# Altium schematic sheet 39-996 - SM Clock-Timer.SchDoc
size A2
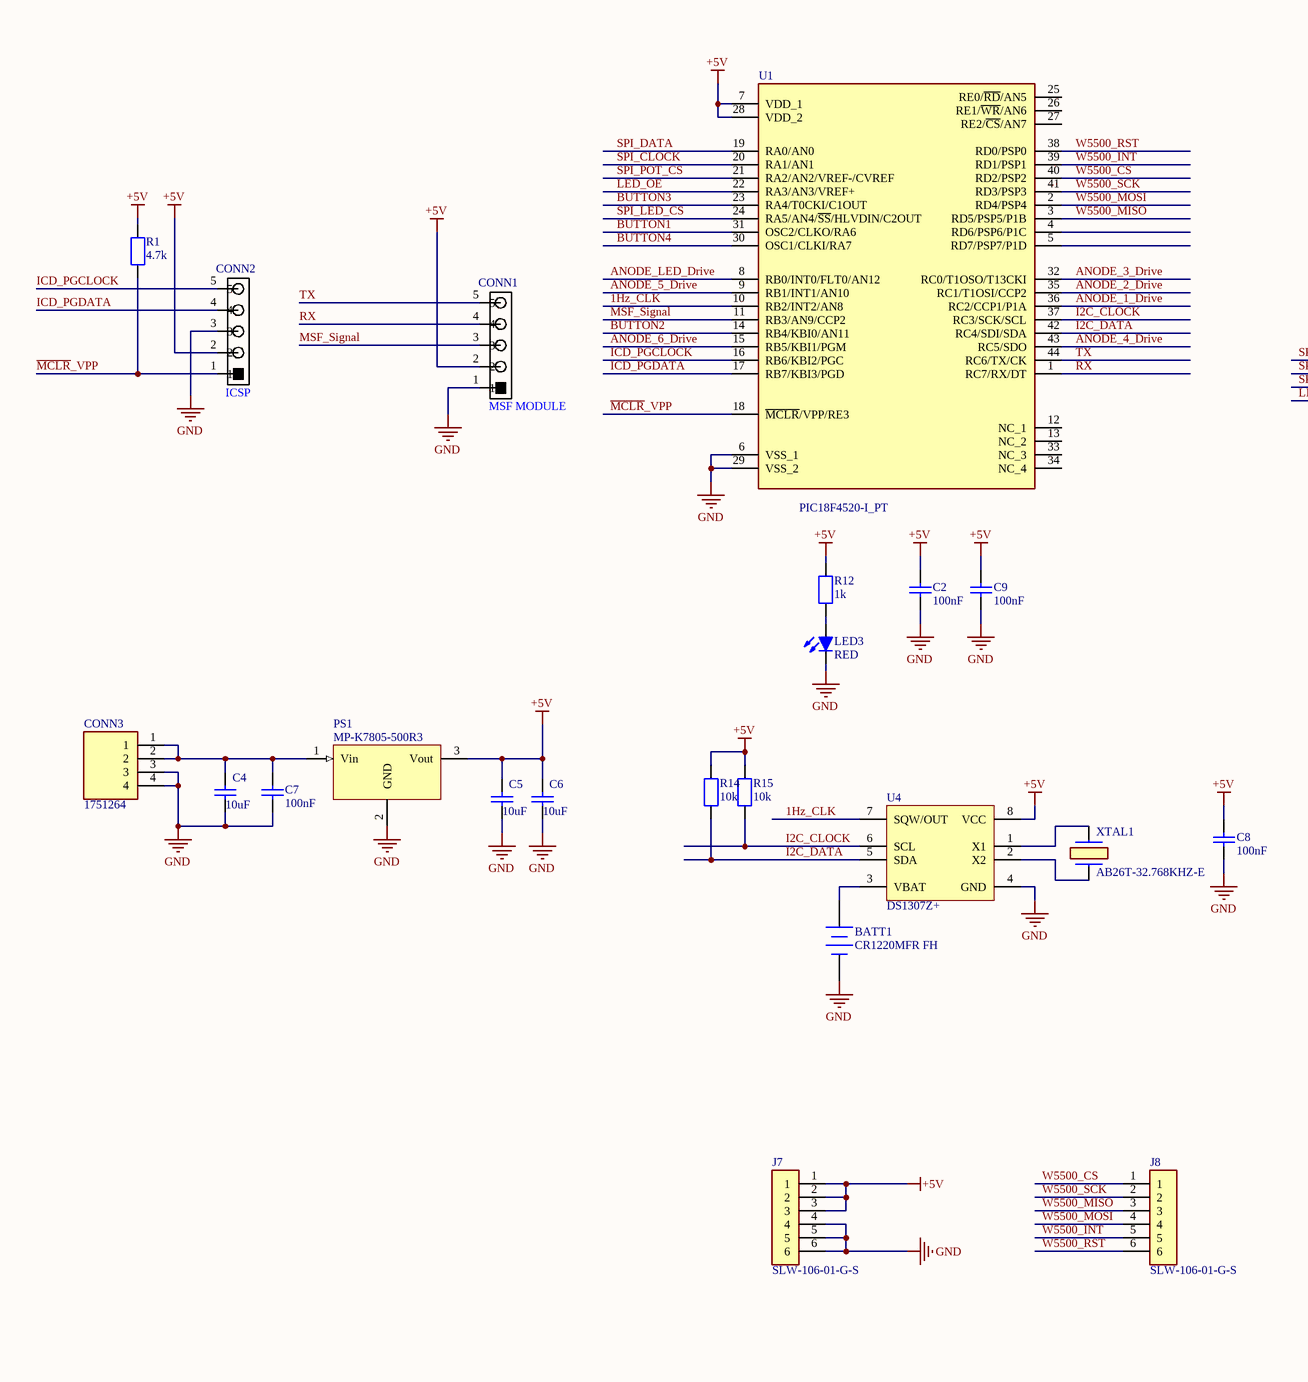
[diagram p0: 39-996 - SM Clock-Timer.SchDoc, left]
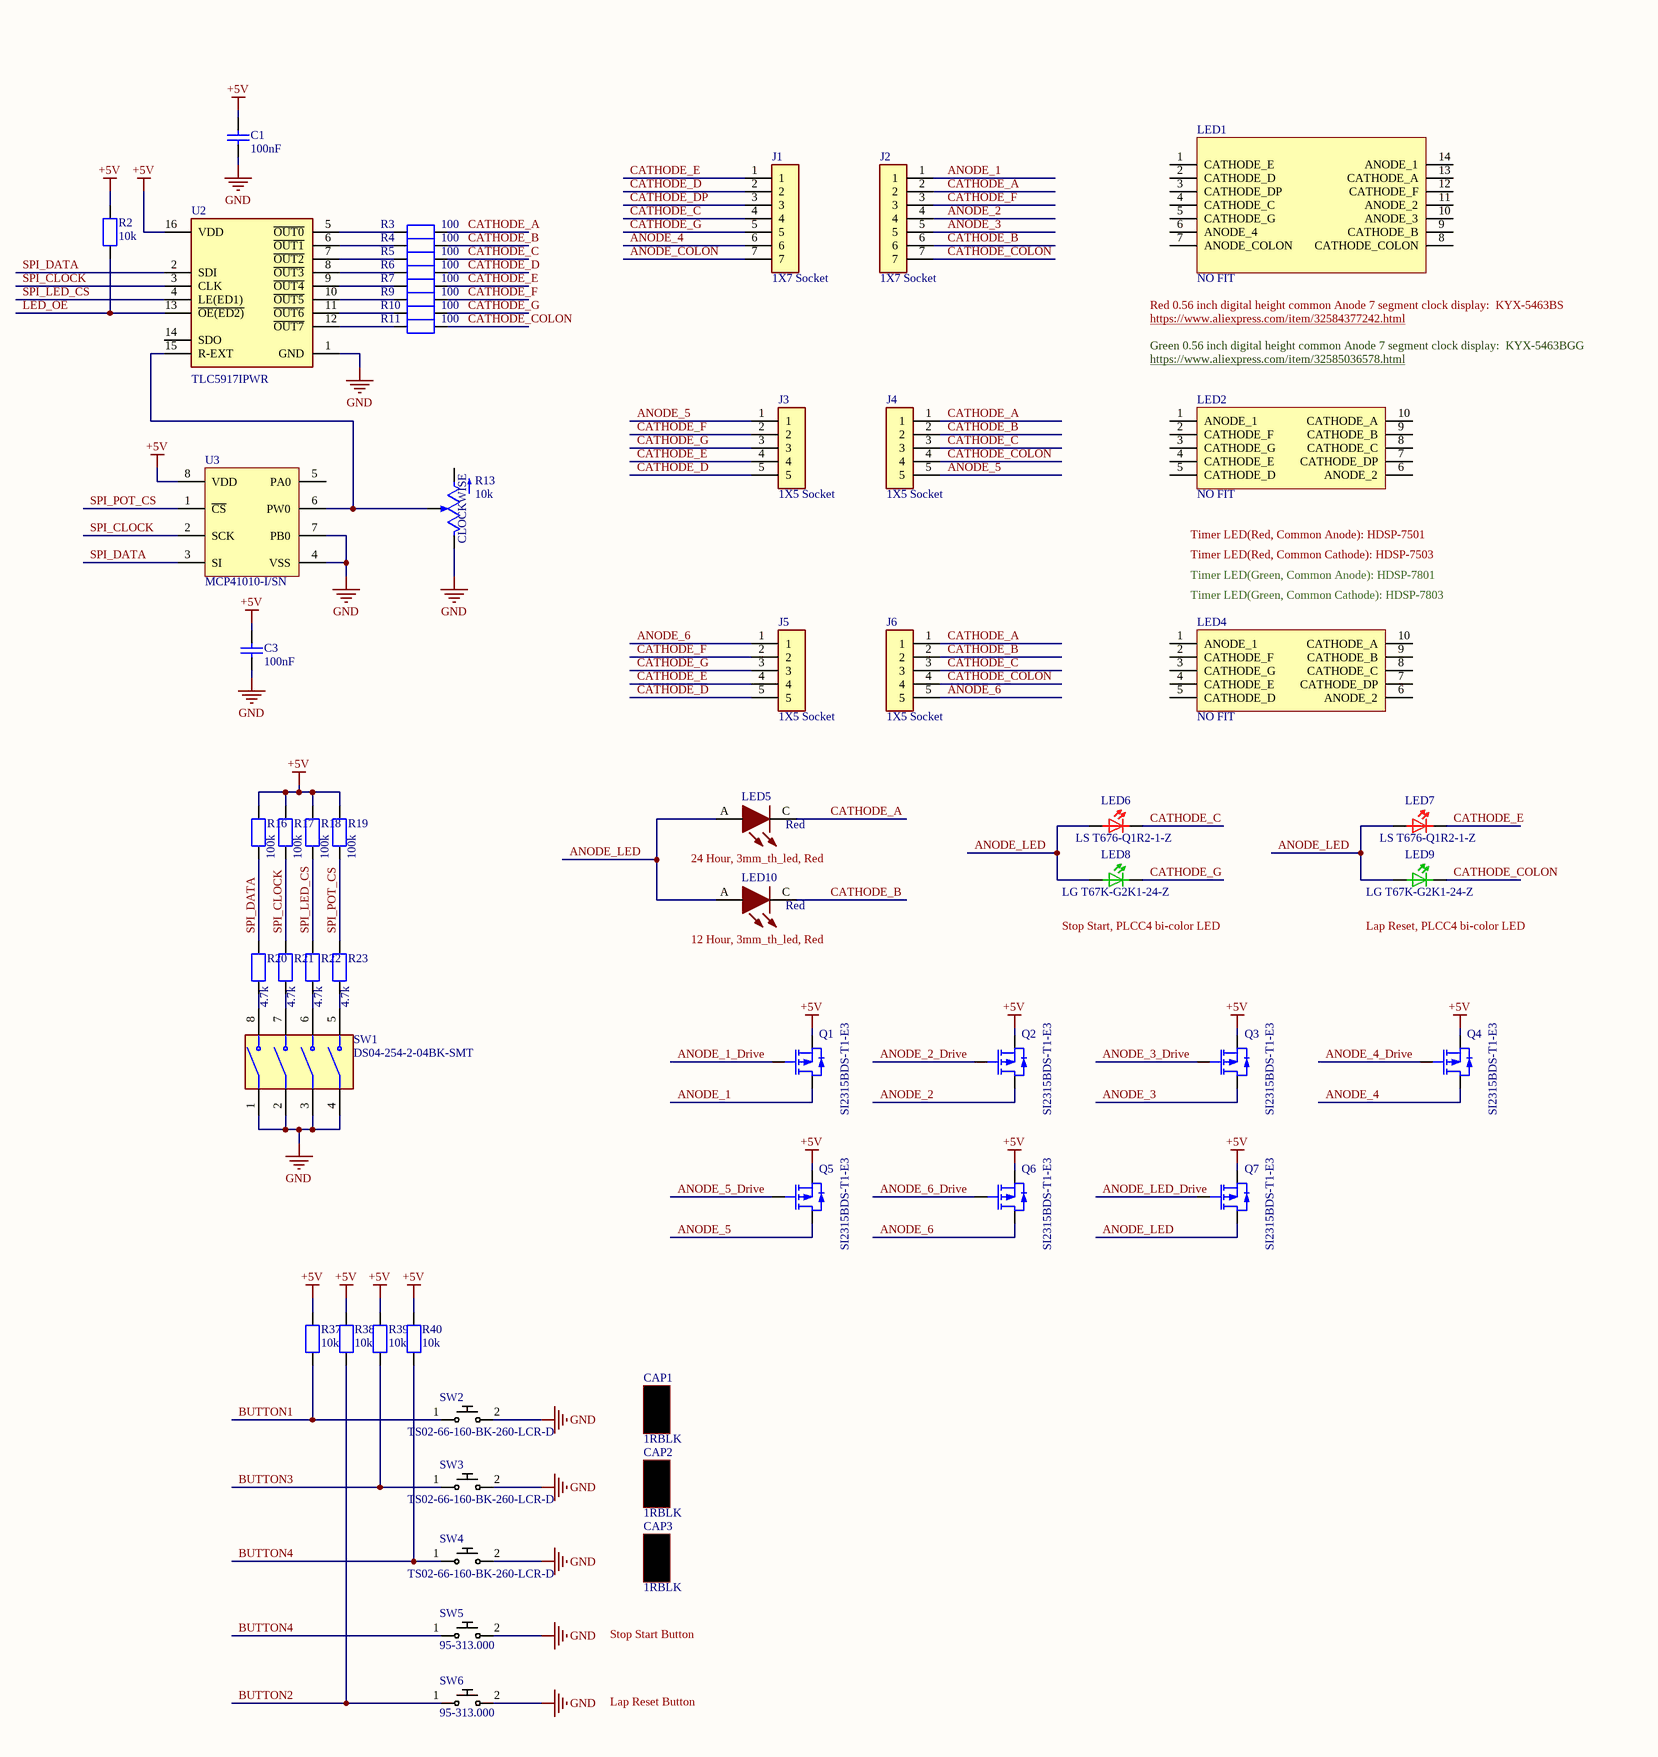
[diagram p1: 39-996 - SM Clock-Timer.SchDoc, right]

## Parts
BATT1  CR1220MFR FH  [CR1220MFRFH]
C1  100nF  [C0603]
C2  100nF  [C0603]
C3  100nF  [C0603]
C4  10uF  [C1206]
C5  10uF  [C1206]
C6  10uF  [C1206]
C7  100nF  [C0603]
C8  100nF  [C0603]
C9  100nF  [C0603]
CAP1  1RBLK  [1RBLK]
CAP2  1RBLK  [1RBLK]
CAP3  1RBLK  [1RBLK]
CONN1  NO FIT  [ICSP]  (value not drawn)
CONN2  NO FIT  [ICSP]  (value not drawn)
CONN3  1751264  [1751264]
J1  1X7 Socket  [D019970742]
J2  1X7 Socket  [D019970742]
J3  1X5 Socket  [D01-9970542]
J4  1X5 Socket  [D01-9970542]
J5  1X5 Socket  [D01-9970542]
J6  1X5 Socket  [D01-9970542]
J7  SLW-106-01-G-S  [SLW-106-01-G-S]
J8  SLW-106-01-G-S  [SLW-106-01-G-S]
LED1  NO FIT  [Common Cathode 7 Segment Clock Display]
LED2  NO FIT  [HDSP7501]
LED3  RED  [LED_PLCC2]
LED4  NO FIT  [HDSP7501]
LED5  Red  [LED_3mm]
LED6  LS T676-Q1R2-1-Z  [PLCC-2]
LED7  LS T676-Q1R2-1-Z  [PLCC-2]
LED8  LG T67K-G2K1-24-Z  [PLCC-2]
LED9  LG T67K-G2K1-24-Z  [PLCC-2]
LED10  Red  [LED_3mm]
PS1  MP-K7805-500R3  [CONV_K7805-500R3]
Q1  SI2315BDS-T1-E3  [SOT23-3]
Q2  SI2315BDS-T1-E3  [SOT23-3]
Q3  SI2315BDS-T1-E3  [SOT23-3]
Q4  SI2315BDS-T1-E3  [SOT23-3]
Q5  SI2315BDS-T1-E3  [SOT23-3]
Q6  SI2315BDS-T1-E3  [SOT23-3]
Q7  SI2315BDS-T1-E3  [SOT23-3]
R1  4.7k  [R0603]
R2  10k  [R0603]
R3  100  [R0603]
R4  100  [R0603]
R5  100  [R0603]
R6  100  [R0603]
R7  100  [R0603]
R9  100  [R0603]
R10  100  [R0603]
R11  100  [R0603]
R12  1k  [R0603]
R13  10k  [TRIM_3386F-1-103LF]
R14  10k  [R0603]
R15  10k  [R0603]
R16  100k  [R0603]
R17  100k  [R0603]
R18  100k  [R0603]
R19  100k  [R0603]
R20  4.7k  [R0603]
R21  4.7k  [R0603]
R22  4.7k  [R0603]
R23  4.7k  [R0603]
R37  10k  [R0603]
R38  10k  [R0603]
R39  10k  [R0603]
R40  10k  [R0603]
SW1  DS04-254-2-04BK-SMT  [SW_DS04-254-2-04BK-SMT]
SW2  TS02-66-160-BK-260-LCR-D  [SW_TS02-66-160-BK-260-LCR-D]
SW3  TS02-66-160-BK-260-LCR-D  [SW_TS02-66-160-BK-260-LCR-D]
SW4  TS02-66-160-BK-260-LCR-D  [SW_TS02-66-160-BK-260-LCR-D]
SW5  95-313.000  [PUSHBUTTON_95-313.000]
SW6  95-313.000  [PUSHBUTTON_95-313.000]
U1  PIC18F4520-I_PT  [TQFP-44]
U2  TLC5917IPWR  [SOIC-16]
U3  MCP41010-I/SN  [SOIC-8]
U4  DS1307Z+  [SOIC-8]
XTAL1  AB26T-32.768KHZ-E  [AB26T32768KHZE]

## Nets
+5V: C1.2 C2.2 C3.2 C5.2 C6.2 C8.2 C9.2 CONN1.2 CONN2.2 J7.1 J7.2 J7.3 PS1.3(Vout) Q1.2(S) Q2.2(S) Q3.2(S) Q4.2(S) Q5.2(S) Q6.2(S) Q7.2(S) R1.2 R2.2 R12.2 R14.2 R15.2 R16.2 R17.2 R18.2 R19.2 R37.2 R38.2 R39.2 R40.2 U1.7(VDD_1) U1.28(VDD_2) U2.16(VDD) U3.8(VDD) U4.8(VCC)
GND: BATT1.- C1.1 C2.1 C3.1 C4.1 C5.1 C6.1 C7.1 C8.1 C9.1 CONN1.1 CONN2.3 CONN3.3 CONN3.4 J7.4 J7.5 J7.6 LED3.1 PS1.2(GND) R13.1(CCW) SW1.1 SW1.2 SW1.3 SW1.4 SW2.2 SW3.2 SW4.2 SW5.2 SW6.2 U1.6(VSS_1) U1.29(VSS_2) U2.1(GND) U3.4(VSS) U3.7(PB0) U4.4(GND)
1Hz_CLK: U1.10(RB2/INT2/AN8) U4.7(SQW/OUT)
ANODE_1: J2.1 Q1.3(D)
ANODE_1_Drive: Q1.1(G) U1.36(RC2/CCP1/P1A)
ANODE_2: J2.4 Q2.3(D)
ANODE_2_Drive: Q2.1(G) U1.35(RC1/T1OSI/CCP2)
ANODE_3: J2.5 Q3.3(D)
ANODE_3_Drive: Q3.1(G) U1.32(RC0/T1OSO/T13CKI)
ANODE_4: J1.6 Q4.3(D)
ANODE_4_Drive: Q4.1(G) U1.43(RC5/SDO)
ANODE_5: J3.1 J4.5 Q5.3(D)
ANODE_5_Drive: Q5.1(G) U1.9(RB1/INT1/AN10)
ANODE_6: J5.1 J6.5 Q6.3(D)
ANODE_6_Drive: Q6.1(G) U1.15(RB5/KBI1/PGM)
ANODE_COLON: J1.7
ANODE_LED: LED5.A LED6.A LED7.A LED8.A LED9.A LED10.A Q7.3(D)
ANODE_LED_Drive: Q7.1(G) U1.8(RB0/INT0/FLT0/AN12)
BUTTON1: R37.1 SW2.1 U1.31(OSC2/CLKO/RA6)
BUTTON2: R38.1 SW6.1 U1.14(RB4/KBI0/AN11)
BUTTON3: R39.1 SW3.1 U1.23(RA4/T0CKI/C1OUT)
BUTTON4: R40.1 SW4.1 SW5.1 U1.30(OSC1/CLKI/RA7)
CATHODE_A: J2.2 J4.1 J6.1 LED5.C R3.2
CATHODE_B: J2.6 J4.2 J6.2 LED10.C R4.2
CATHODE_C: J1.4 J4.3 J6.3 LED6.C R5.2
CATHODE_COLON: J2.7 J4.4 J6.4 LED9.C R11.2
CATHODE_D: J1.2 J3.5 J5.5 R6.2
CATHODE_DP: J1.3
CATHODE_E: J1.1 J3.4 J5.4 LED7.C R7.2
CATHODE_F: J2.3 J3.2 J5.2 R9.2
CATHODE_G: J1.5 J3.3 J5.3 LED8.C R10.2
I2C_CLOCK: R15.1 U1.37(RC3/SCK/SCL) U4.6(SCL)
I2C_DATA: R14.1 U1.42(RC4/SDI/SDA) U4.5(SDA)
ICD_PGCLOCK: CONN2.5 U1.16(RB6/KBI2/PGC)
ICD_PGDATA: CONN2.4 U1.17(RB7/KBI3/PGD)
~{LED_OE}: R2.1 U1.22(RA3/AN3/VREF+) U2.13(~{OE(ED2)})
~{MCLR}_VPP: CONN2.1 R1.1 U1.18(~{MCLR}/VPP/RE3)
MSF_Signal: CONN1.3 U1.11(RB3/AN9/CCP2)
RX: CONN1.4 U1.1(RC7/RX/DT)
SPI_CLOCK: R17.1 R21.2 U1.20(RA1/AN1) U2.3(CLK) U3.2(SCK)
SPI_DATA: R16.1 R20.2 U1.19(RA0/AN0) U2.2(SDI) U3.3(SI)
SPI_LED_CS: R18.1 R22.2 U1.24(RA5/AN4/~{SS}/HLVDIN/C2OUT) U2.4(LE(ED1))
SPI_POT_CS: R19.1 R23.2 U1.21(RA2/AN2/VREF-/CVREF) U3.1(~{CS})
TX: CONN1.5 U1.44(RC6/TX/CK)
W5500_CS: J8.1 U1.40(RD2/PSP2)
W5500_INT: J8.5 U1.39(RD1/PSP1)
W5500_MISO: J8.3 U1.3(RD5/PSP5/P1B)
W5500_MOSI: J8.4 U1.2(RD4/PSP4)
W5500_RST: J8.6 U1.38(RD0/PSP0)
W5500_SCK: J8.2 U1.41(RD3/PSP3)
NetBATT1_+: BATT1.+ U4.3(VBAT)
NetC4_2: C4.2 C7.2 CONN3.1 CONN3.2 PS1.1(Vin)
NetLED3_2: LED3.2 R12.1
NetR3_1: R3.1 U2.5(~{OUT0})
NetR4_1: R4.1 U2.6(~{OUT1})
NetR5_1: R5.1 U2.7(~{OUT2})
NetR6_1: R6.1 U2.8(~{OUT3})
NetR7_1: R7.1 U2.9(~{OUT4})
NetR9_1: R9.1 U2.10(~{OUT5})
NetR10_1: R10.1 U2.11(~{OUT6})
NetR11_1: R11.1 U2.12(~{OUT7})
NetR13_2: R13.2(WIPER) U2.15(R-EXT) U3.6(PW0)
NetR20_1: R20.1 SW1.8
NetR21_1: R21.1 SW1.7
NetR22_1: R22.1 SW1.6
NetR23_1: R23.1 SW1.5
NetU4_1: U4.1(X1) XTAL1.2
NetU4_2: U4.2(X2) XTAL1.1

Not connected (* = marked no-connect by the designer): LED1 1(CATHODE_E) 2(CATHODE_D) 3(CATHODE_DP) 4(CATHODE_C) 5(CATHODE_G) 6(ANODE_4) 7(ANODE_COLON) 8(CATHODE_COLON) 9(CATHODE_B) 10(ANODE_3) 11(ANODE_2) 12(CATHODE_F) 13(CATHODE_A) 14(ANODE_1); LED2 1(ANODE_1) 2(CATHODE_F) 3(CATHODE_G) 4(CATHODE_E) 5(CATHODE_D) 6(ANODE_2) 7(CATHODE_DP) 8(CATHODE_C) 9(CATHODE_B) 10(CATHODE_A); LED4 1(ANODE_1) 2(CATHODE_F) 3(CATHODE_G) 4(CATHODE_E) 5(CATHODE_D) 6(ANODE_2) 7(CATHODE_DP) 8(CATHODE_C) 9(CATHODE_B) 10(CATHODE_A); R13 3(CW); U1 4(RD6/PSP6/P1C) 5(RD7/PSP7/P1D) 12(NC_1) 13(NC_2) 25(RE0/~{RD}/AN5) 26(RE1/~{WR}/AN6) 27(RE2/~{CS}/AN7) 33(NC_3) 34(NC_4); U2 14(SDO); U3 5(PA0)

## Notes on the sheet
- (near CONN2) ICSP
- (near CONN1) MSF MODULE
- Red 0.56 inch digital height common Anode 7 segment clock display:  KYX-5463BS
- https://www.aliexpress.com/item/32584377242.html
- Green 0.56 inch digital height common Anode 7 segment clock display:  KYX-5463BGG
- https://www.aliexpress.com/item/32585036578.html
- Timer LED(Red, Common Cathode): HDSP-7503
- Timer LED(Red, Common Anode): HDSP-7501
- Timer LED(Green, Common Anode): HDSP-7801
- (near LED4) Timer LED(Green, Common Cathode): HDSP-7803
- 24 Hour, 3mm_th_led, Red
- (near LED10) 12 Hour, 3mm_th_led, Red
- (near LED8) Stop Start, PLCC4 bi-color LED
- (near LED9) Lap Reset, PLCC4 bi-color LED
- (near CAP3) Stop Start Button
- Lap Reset Button
- (in symbol 3386F-1-103LF) CLOCKWISE

## Library data of the parts
BATT1 = CR1220MFR FH: Coin Cell Battery 3V2-PINHORZ40mAh; Manufacturer: Renata; Supplier: Mouser; Supplier Part Number: 614-CR1220MFR-FH; Manufacturer Part Number: CR1220MFR FH; Value: CR1220MFR FH
C1-C3 C7-C9 = 100nF ± 10% 50V: Manufacturer: Yageo; Manufacturer Part Number: CC0603KRX7R9BB104; Value: 100nF; Supplier: Mouser; Supplier Part Number: 603-CC603KRX7R9BB104; Price: 0.1
C4-C6 = 10uF ± 10% 50V: Manufacturer: Murata; Manufacturer Part Number: GRT31CR61H106KE01L; Value: 10uF; Supplier: Mouser; Supplier Part Number: 81-GRT31CR61H106KE1L; Price: 0.5
CAP1-CAP3 = 1RBLK: Switch Bezels / Switch Caps 9 X 5MM RND CAP BLK; Manufacturer: E-Switch; Manufacturer Part Number: 1RBLK; Value: 1RBLK; Supplier: Mouser; Supplier Part Number: 612-1R-BK; Price: 0.22
CONN1 CONN2 = ICSP: ICSP Header - 5 Pin, 2.54mm Pitch
CONN3 = 1751264: Fixed Terminal Blocks 4P 3.5mm 90DEG; Manufacturer: Phoenix Contact; Supplier Part Number: 651-1751264; Price: 2.62; Manufacturer Part Number: 1751264; Value: 1751264; Supplier: Mouser
J1 J2 = D01-9970742: IC & Component Sockets 7 WAY SIL VERT SKT; Manufacturer: Harwin; Value: 1X7 Socket; Price: 1; Manufacturer Part Number: D01-9970742; Supplier: Mouser; Supplier Part Number: 855-D01-9970742
J3-J6 = D01-9970542: IC & Component Sockets 5 WAY SIL VERT SKT; Manufacturer: Harwin; Value: 1X5 Socket; Price: 0.7; Manufacturer Part Number: D01-9970542; Supplier: Mouser; Supplier Part Number: 855-D01-9970542
J7 J8 = SLW-106-01-G-S: Headers & Wire Housings .100" Tiger Buy Low Profile Socket Strip; Manufacturer: Samtec; Supplier Part Number: 200-SLW10601GS; Price: 1.53; Manufacturer Part Number: SLW-106-01-G-S; Value: SLW-106-01-G-S; Supplier: Mouser
LED1 = Common Anode 7 Segment Clock Display: 0.56 inch digit height common Anode 7 segment clock display
LED2 LED4 = HDSP-7501: 7 SEG NUMERIC DISPLAY, HIGH EFFICIENCY RED, 7.6 mm; Manufacturer: Avago Technologies; Supplier Part Number: 630-HDSP-7501; Price: 3.6; Manufacturer Part Number: HDSP-7501; Supplier: Mouser; Value: HDSP-7501
LED3 LED6 LED7 = LS T676-Q1R2-1-Z: Standard LEDs - SMD Super Red, 645nm 180mcd, 20mA; Manufacturer: ams OSRAM; Manufacturer Part Number: LS T676-Q1R2-1-Z; Supplier Part Number: 720-LST676-Q1R2-1-Z; Price: 0.3; Value: LS T676-Q1R2-1-Z
  LED3: Supplier: mouser
  LED6 LED7: Supplier: Mouser
LED5 LED10 = WP132XID: Standard LEDs - Through Hole RED DIFFUSED; Manufacturer: Kingbright; Manufacturer Part Number: WP132XID; Height: mm; Colour: Red; Supplier: Mouser; Supplier Part Number: 604-WP132XID; Value: Red; Price: 0.28
LED8 LED9 = LG T67K-G2K1-24-Z: Standard LEDs - SMD Green 570nm, 20mA; Manufacturer: ams OSRAM; Manufacturer Part Number: LG T67K-G2K1-24-Z; Value: LG T67K-G2K1-24-Z; Price: 0.3; Supplier: Mouser; Supplier Part Number: 720-LGT67KG2K124Z
PS1 = MP-K7805-500R3: Linear Regulator Replacement DC DC Converter 1 Output 5V, -5V - - - 500mA, 300mA 6.5V, 7V - 36V, 31V Input; Manufacturer: MULTICOMP PRO; Supplier: Farnell; Supplier Part Number: 3584025; Price: None; Value: MP-K7805-500R3; Manufacturer Part Number: MP-K7805-500R3
Q1-Q7 = SI2315BDS-T1-E3: MOSFET 1.8V 3.2A 1.25W; Manufacturer: Vishay Semiconductors; Manufacturer Part Number: SI2315BDS-T1-E3; Value: SI2315BDS-T1-E3; Supplier: Mouser; Supplier Part Number: 781-SI2315BDS-E3; Price: 0.5
R1 R20-R23 = 4.7 kOhms ±1% 0.1W: Manufacturer: Yageo; Manufacturer Part Number: RC0603FR-074K7L; Value: 4.7k; Supplier: Mouser; Supplier Part Number: 603-RC0603FR-074K7L; Price: 0.1
R2 R14 R15 R37-R40 = 10 kOhms ±1% 0.1W: Manufacturer: Yageo; Manufacturer Part Number: RC0603FR-0710KL; Value: 10k; Supplier: Mouser; Supplier Part Number: 603-RC0603FR-0710KL; Price: 0.1
R3-R7 R9-R11 = 100 Ohms ±1% 0.1W: Manufacturer: Yageo; Manufacturer Part Number: RC0603FR-07100RL; Value: 100; Supplier: Mouser; Supplier Part Number: 603-RC0603FR-07100RL; Price: 0.1
R12 = 1 kOhms ±1% 0.1W: Manufacturer: Yageo; Manufacturer Part Number: RC0603FR-071KL; Value: 1k; Supplier: Mouser; Supplier Part Number: 603-RC0603FR-071KL; Price: 0.1
R13 = 3386F-1-103LF: Trimmer Resistors - Through Hole 3/8" 10Kohms 10% 0.5Watts Square; Manufacturer: Bourns; Price: 1.5; Manufacturer Part Number: 3386F-1-103LF; Value: 10k; Supplier: Mouser; Supplier Part Number: 652-3386F-1-103LF
R16-R19 = 100 kOhms ±1% 0.1W: Manufacturer: Yageo; Manufacturer Part Number: RC0603FR-07100KL; Value: 100k; Supplier: Mouser; Supplier Part Number: 603-RC0603FR-07100KL; Price: 0.1
SW1 = DS04-254-2-04BK-SMT: DIP Switches/SIP Switches DIP Switch, SPST, 2.54 pitch, flat actuator, SMT, 4 position, Black; Manufacturer: CUI Devices; Supplier Part Number: 490-DS04254204BK-SMT; Value: DS04-254-2-04BK-SMT; Price: 0.6; Manufacturer Part Number: DS04-254-2-04BK-SMT; Supplier: Mouser
SW2-SW4 = TS02-66-160-BK-260-LCR-D: Tactile Switches 6 x 6 mm, 16 mm Act Height, 260 gf, Black, Long Crimped, Through Hole, SPST,; Manufacturer: CUI Devices; Manufacturer Part Number: TS02-66-160-BK-260-LCR-D; Value: TS02-66-160-BK-260-LCR-D; Supplier: Mouser; Supplier Part Number: 179-TS0266160BK260LC; Price: 0.12
SW5 SW6 = 95-313.000: Switching element square, 12.7 x 12.7 mm; Manufacturer: eao; Manufacturer Part Number: 95-313.000; Value: 95-313.000; Supplier: *; Supplier Part Number: *; Price: *
U1 = PIC18F4520-I_PT: MCU 32 KB Flash,1536 RAM, 36 I/O; Manufacturer: Microchip; Manufacturer Part Number: PIC18F4520-I/PT; Value: PIC18F4520-I/PT; Supplier Part Number: 579-PIC18F4520-I/PT; Price: 6; Supplier: Mouser
U2 = TLC5917IPWR: LED Lighting Drivers 8B Constant-Current LED Sink; Manufacturer: Texas Instruments; Supplier Part Number: 595-TLC5917IPWR; Price: 1.8; Manufacturer Part Number: TLC5917IPWR; Supplier: Mouser; Value: TLC5917IPWR
U3 = MCP41010-I/SN: Digital Potentiometer 10K 256pos SPI SO8; Manufacturer: Microchip; Supplier Part Number: 579-MCP41010-I/SN; Price: 1.8; Manufacturer Part Number: MCP41010-I/SN; Supplier: Mouser; Value: MCP41010-I/SN
U4 = DS1307Z+: DS1307Z+, Real Time Clock, Alarm, Calendar, Clock, 56B RAM, I2C, 5V, 8-Pin SOIC; Manufacturer: Analog Devices; Value: 1.75mm; Supplier Part Number: 700-DS1307Z; Price: 4.5; Manufacturer Part Number: DS1307Z+; Supplier: Mouser
XTAL1 = AB26T-32.768KHZ-E: OSC XO 1.33GHZ 2.5V LVPECL; Manufacturer: ABRACON; Supplier Part Number: 815-AB26T32.768KHZE; Price: 0.15; Manufacturer Part Number: AB26T-32.768KHZ-E; Value: https://abracon.com/Resonators/AB26T.pdf; Supplier: Mouser